# Altium schematic sheet Title Sheet.SchDoc: STM32F446 CNC
size B; Author: AM; CompanyName: Expatria Technologies; DrawnBy: A.Marles; Engineer: AM; Organization: Expatria Technolgoies; DocumentNumber: 1; SheetNumber: 1; SheetTotal: 14
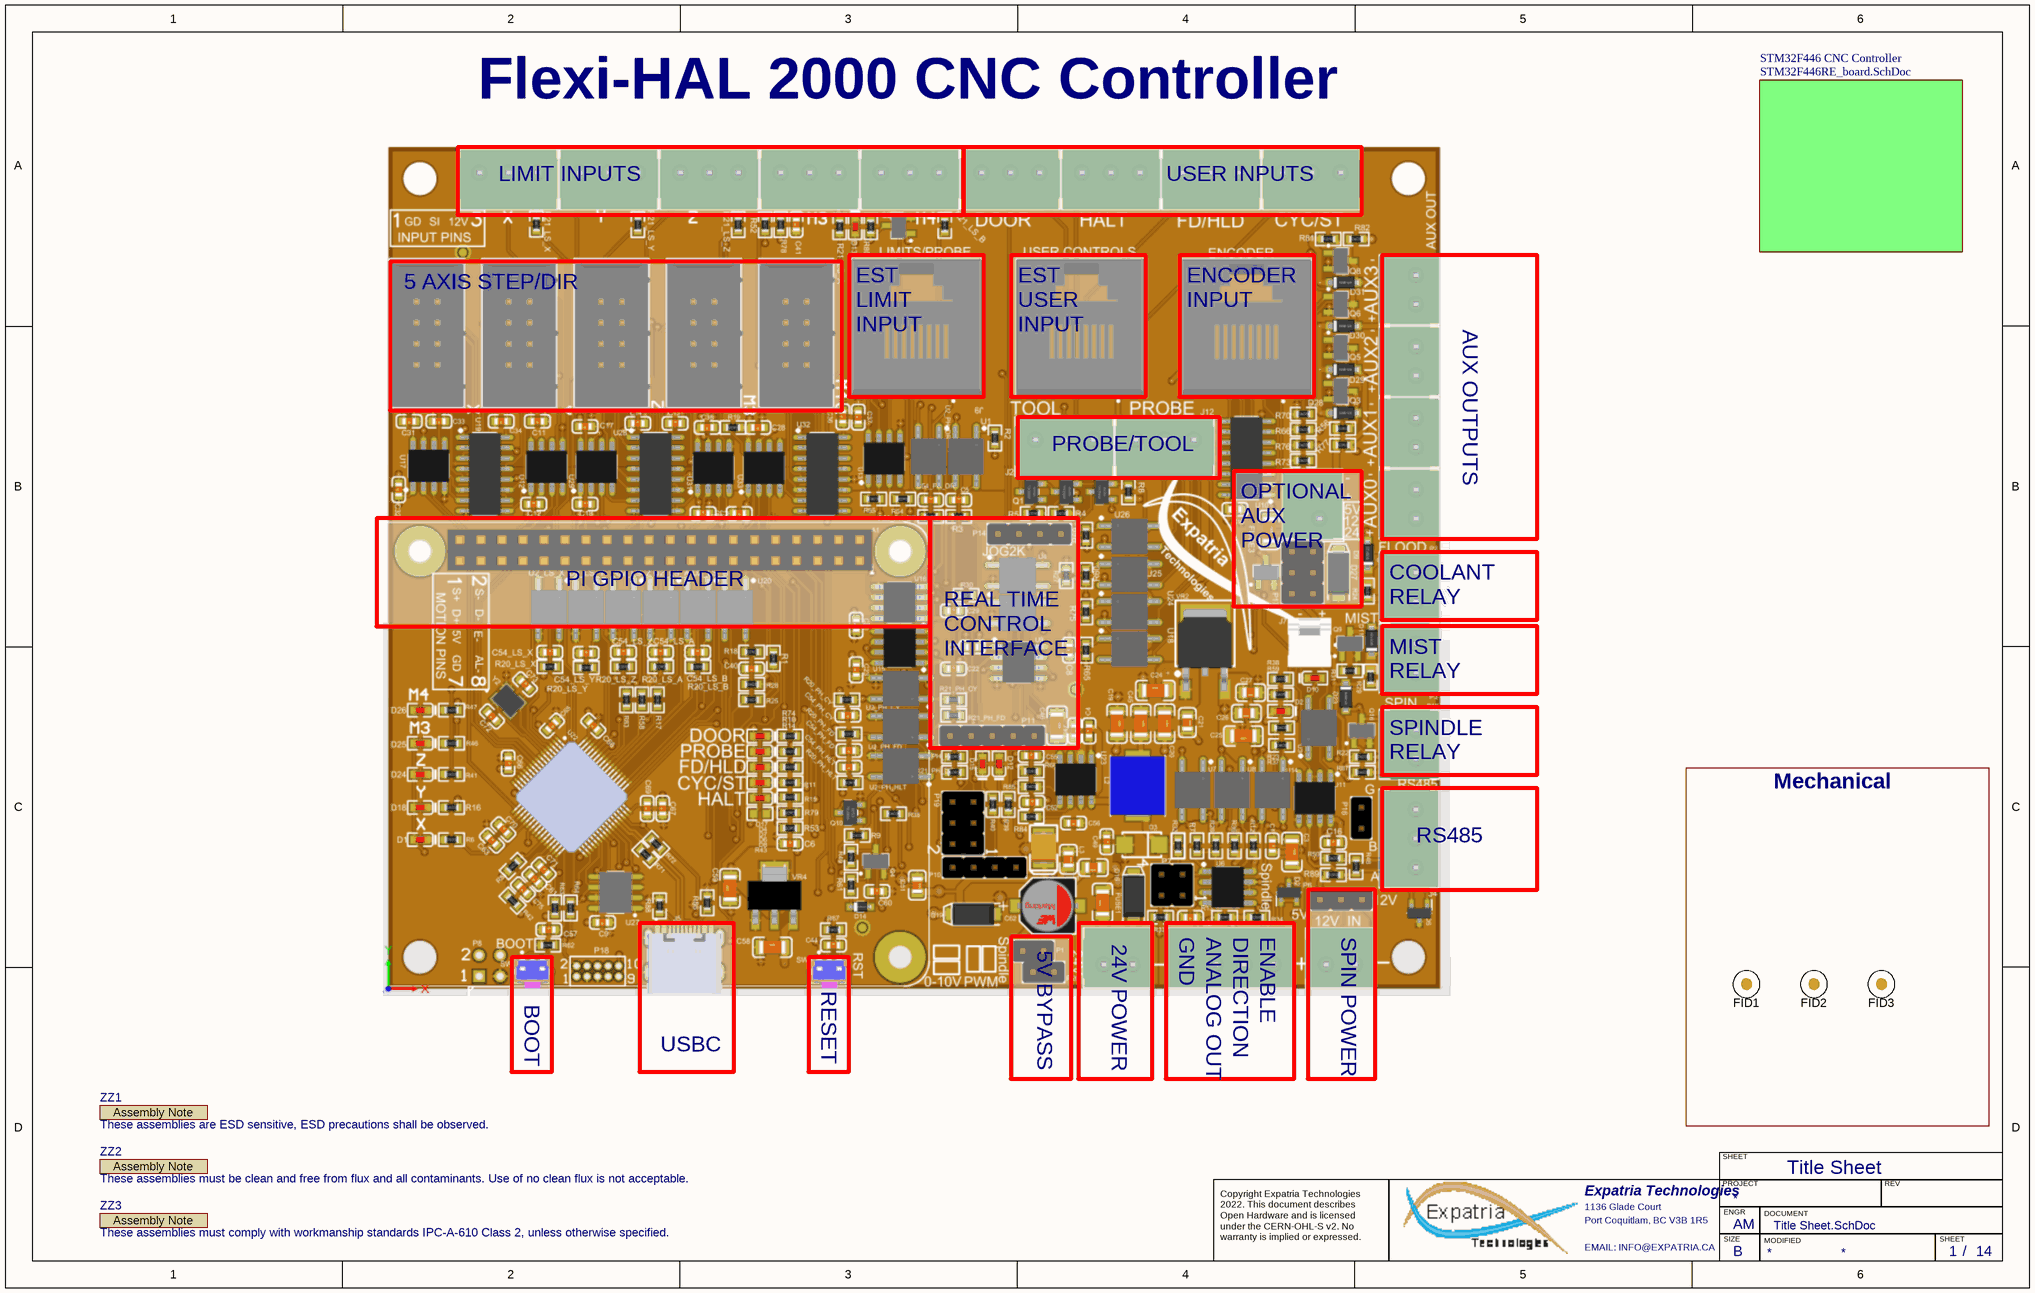
[diagram p0: Title Sheet.SchDoc]

## Parts
FID1  Fiducial  [Fiducial10-20]  (value not drawn)  (no BOM)
FID2  Fiducial  [Fiducial10-20]  (value not drawn)  (no BOM)
FID3  Fiducial  [Fiducial10-20]  (value not drawn)  (no BOM)
ZZ1  These assemblies are ESD sensitive, ESD precautions shall be observed.  [AssemblyNote]  (graphical)
ZZ2  These assemblies must be clean and free from flux and all contaminants. Use of no clean flux is not acceptable.  [AssemblyNote]  (graphical)
ZZ3  These assemblies must comply with workmanship standards IPC-A-610 Class 2, unless otherwise specified.  [AssemblyNote]  (graphical)

## Blocks framed on the sheet
Mechanical: FID1-FID3

## Sub-sheets
STM32F446 CNC Controller = STM32F446RE_board.SchDoc: no entries

## Notes on the sheet
- Flexi-HAL 2000 CNC Controller
- LIMIT INPUTS
- USER INPUTS
- 5 AXIS STEP/DIR
- EST
  LIMIT
  INPUT
- EST
  USER
  INPUT
- ENCODER
  INPUT
- AUX OUTPUTS
- PROBE/TOOL
- OPTIONAL
  AUX
  POWER
- PI GPIO HEADER
- COOLANT
  RELAY
- MIST
  RELAY
- SPINDLE
  RELAY
- REAL TIME CONTROL INTERFACE
- RS485
- 5V BYPASS
- 24V POWER
- GND
- ANALOG OUT
- DIRECTION
- ENABLE
- SPIN POWER
- BOOT
- RESET
- USBC
- Title Sheet
- SHEET
- Expatria Technologies
- 1136 Glade Court
- Port Coquitlam, BC V3B 1R5
- PROJECT
- SIZE
- ENGR
- MODIFIED
- DOCUMENT
- REV
- Copyright Expatria Technologies 2022. This document describes Open Hardware and is licensed under the CERN-OHL-S v2. No warranty is implied or expressed.
- EMAIL: INFO@EXPATRIA.CA
- B
- /
- (in symbol AssemblyNote) Assembly Note

## Library data of the parts
FID1-FID3 = Fiducial: FIDUCIAL NO ASSEMBLY; Manufacturer 1: NONE; Manufacturer Part Number 1: NONE; Value: Fiducial
ZZ1-ZZ3 = AssemblyNote: SymbolCreator: codlsc; SymbolVersion: 2010-05-18; CompType: AssemblyNote; ClassName: AssemblyNote; Publisher: Texas Instruments; LatestRevisionDate: 2012-06-14; LatestRevisionNote: Initial Version; Alternate Manufacturer: -; Alternate PartNumber: -; Parameter 1: *